# Altium schematic sheet PDM.SchDoc
size A4; SheetNumber: 9; SheetTotal: 14
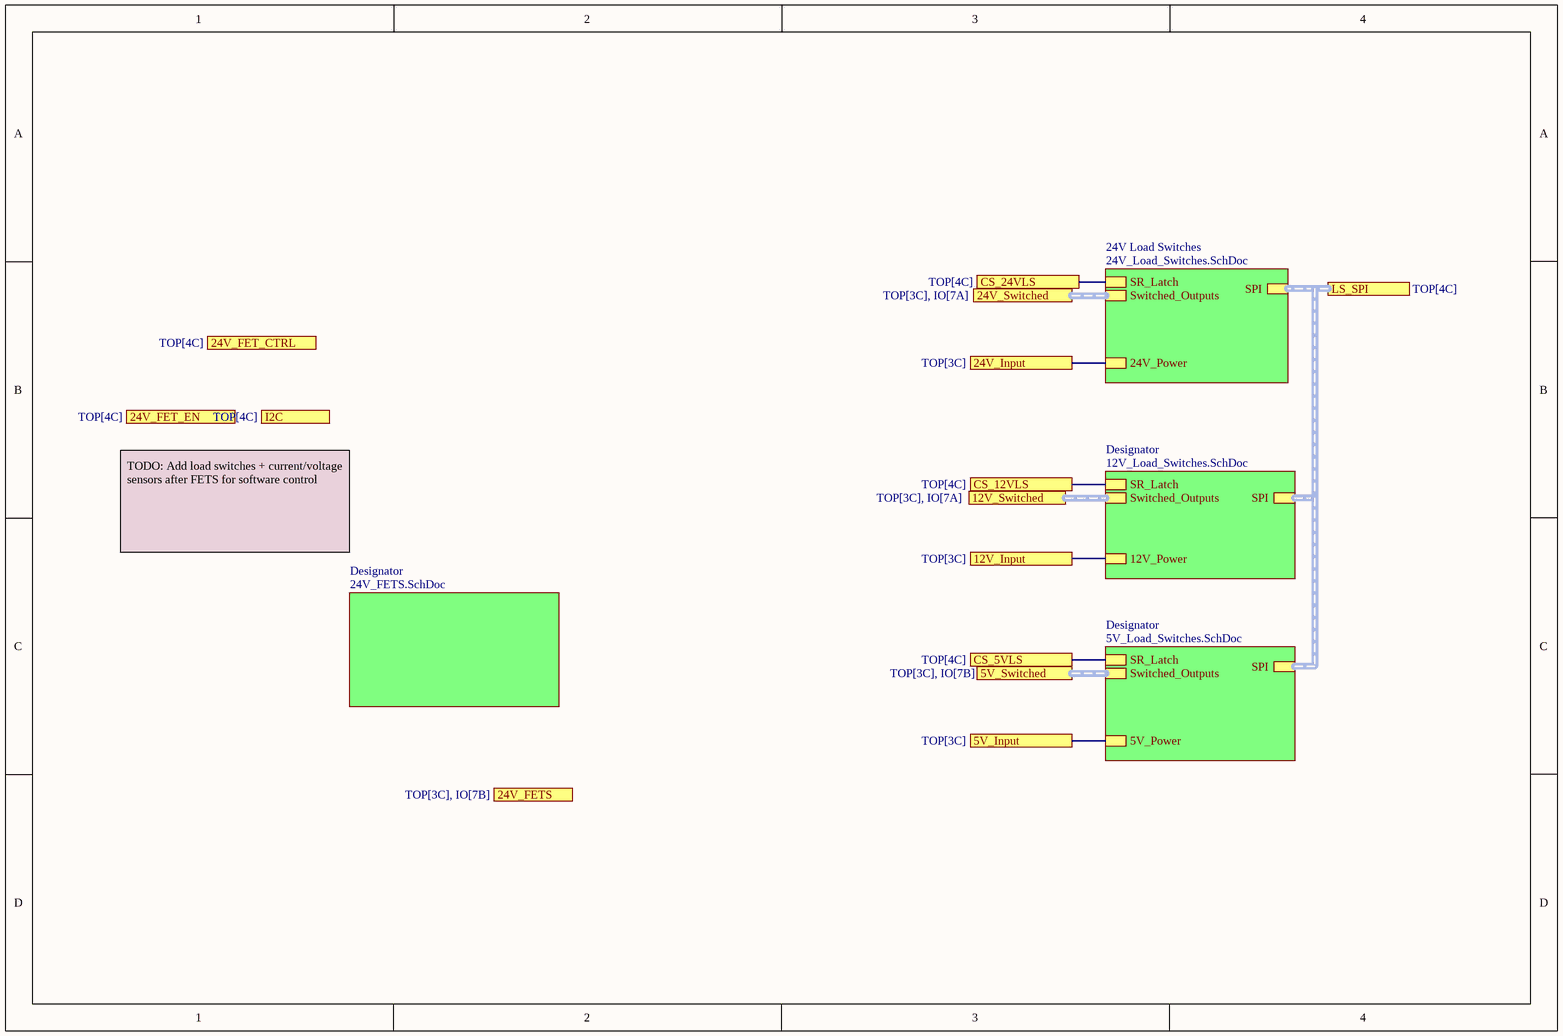
[diagram p0: PDM.SchDoc]

## Sub-sheets
24V Load Switches = 24V_Load_Switches.SchDoc: 24V_Power, SR_Latch, SPI (harness SPI), Switched_Outputs (harness 24V_LoadSwitches)
Designator = 12V_Load_Switches.SchDoc: Switched_Outputs (harness 12V_LoadSwitches), 12V_Power, SR_Latch, SPI (harness SPI)
Designator = 5V_Load_Switches.SchDoc: 5V_Power, Switched_Outputs (harness 5V_LoadSwitches), SR_Latch, SPI (harness SPI)
Designator = 24V_FETS.SchDoc: no entries

## Ports
5V_Input (see TOP[3C]), 5V_Switched (harness 5V_LoadSwitches, see TOP[3C], IO[7B]), 12V_Input (see TOP[3C]), 12V_Switched (harness 12V_LoadSwitches, see TOP[3C], IO[7A]), 24V_FET_CTRL (harness 24V_FETS, see TOP[4C]), 24V_FET_EN (harness 24V_FETS, see TOP[4C]), 24V_FETS (harness 24V_FETS, see TOP[3C], IO[7B]), 24V_Input (see TOP[3C]), 24V_Switched (harness 24V_LoadSwitches, see TOP[3C], IO[7A]), CS_5VLS (see TOP[4C]), CS_12VLS (see TOP[4C]), CS_24VLS (see TOP[4C]), I2C (harness I2C, see TOP[4C]), LS_SPI (harness SPI, see TOP[4C])

## Nets
5V_Input: port 5V_Input, sheet Designator/5V_Power
12V_Input: port 12V_Input, sheet Designator/12V_Power
24V_Input: port 24V_Input, sheet 24V Load Switches/24V_Power
CS_5VLS: port CS_5VLS, sheet Designator/SR_Latch
CS_12VLS: port CS_12VLS, sheet Designator/SR_Latch
CS_24VLS: port CS_24VLS, sheet 24V Load Switches/SR_Latch

## Buses and harness runs
harness port 5V_Switched = sheet Designator/Switched_Outputs
harness port 12V_Switched = sheet Designator/Switched_Outputs
harness port 24V_Switched = sheet 24V Load Switches/Switched_Outputs
harness port LS_SPI = sheet 24V Load Switches/SPI = sheet Designator/SPI

## Notes on the sheet
- TODO: Add load switches + current/voltage sensors after FETS for software control